# EAGLE design Adafruit RFM+LoRa Breakout (EAGLE 6.6.0)
AUTHOR: KTOWN
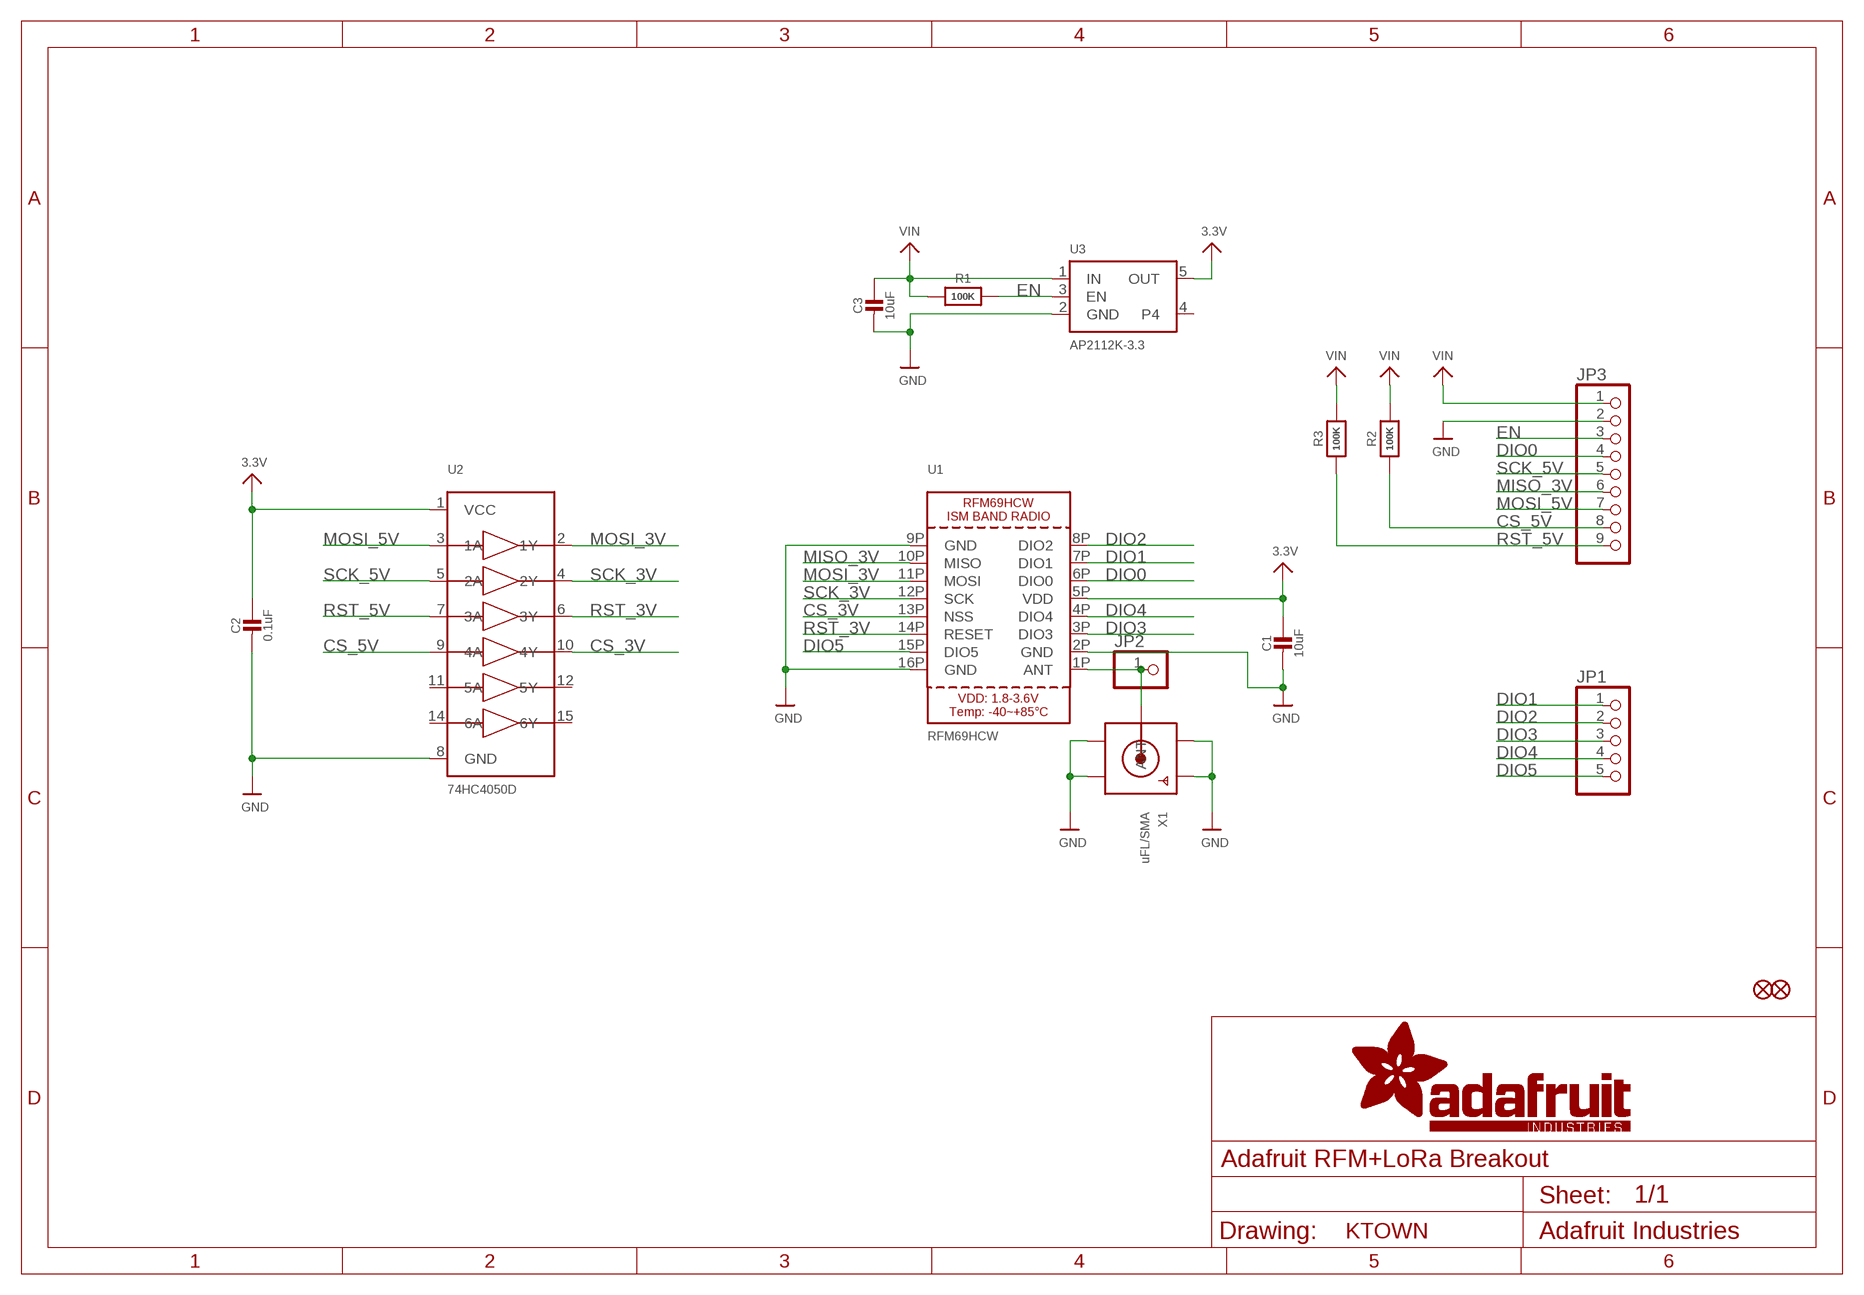
[diagram p0: schematic, sheet 1]

## Parts
C1  10uF  CAP_CERAMIC0805-NOOUTLINE  [0805-NO]
C2  0.1uF  CAP_CERAMIC0805-NOOUTLINE  [0805-NO]
C3  10uF  CAP_CERAMIC0805-NOOUTLINE  [0805-NO]
FID1  FIDUCIAL""  [FIDUCIAL_1MM]
FID2  FIDUCIAL""  [FIDUCIAL_1MM]
JP1  HEADER-1X570MIL  [1X05_ROUND_70]
JP2  HEADER-1X1ROUND  [1X01_ROUND]
JP3  HEADER-1X970MIL  [1X09_ROUND_70]
R1  100K  RESISTOR0805_NOOUTLINE  [0805-NO]
R2  100K  RESISTOR0805_NOOUTLINE  [0805-NO]
R3  100K  RESISTOR0805_NOOUTLINE  [0805-NO]
U1  RFM69HCW  RFM69HCW_SMT  [RFMHCW_SMT]
U2  74HC4050D  74HC4050DTSSOP  [TSSOP16]
U3  AP2112K-3.3  VREG_SOT23-5  [SOT23-5]
X1  uFL/SMA  SMACONNECTOR_EDGE_UFL  [SMA_EDGELAUNCH_UFL]

## Nets
3.3V: C1.1 C2.1 U1.5P(VDD) U2.1(VCC) U3.5(OUT)
CS_3V: U1.13P(NSS) U2.10(4Y)
CS_5V: JP3.8 R2.1 U2.9(4A)
DIO0: JP3.4 U1.6P(DIO0)
DIO1: JP1.1 U1.7P(DIO1)
DIO2: JP1.2 U1.8P(DIO2)
DIO3: JP1.3 U1.3P(DIO3)
DIO4: JP1.4 U1.4P(DIO4)
DIO5: JP1.5 U1.15P(DIO5)
EN: JP3.3 R1.2 U3.3(EN)
GND: C1.2 C2.2 C3.2 JP3.2 U1.2P(GND) U1.9P(GND) U1.16P(GND) U2.8(GND) U3.2(GND) X1.GND@1(GND1) X1.GND@2(GND2) X1.GND@3(GND3) X1.GND@4(GND4)
MISO_3V: JP3.6 U1.10P(MISO)
MOSI_3V: U1.11P(MOSI) U2.2(1Y)
MOSI_5V: JP3.7 U2.3(1A)
N$1: JP2.1 U1.1P(ANT) X1.P(ANT)
RST_3V: U1.14P(RESET) U2.6(3Y)
RST_5V: JP3.9 R3.1 U2.7(3A)
SCK_3V: U1.12P(SCK) U2.4(2Y)
SCK_5V: JP3.5 U2.5(2A)
VIN: C3.1 JP3.1 R1.1 R2.2 R3.2 U3.1(IN)
Unconnected: U2.11(5A) U2.12(5Y) U2.14(6A) U2.15(6Y) U3.4

## Library data of the parts
C1-C3 = microbuilder:CAP_CERAMIC: Ceramic Capacitors For new designs, use the packages preceded by an '_' character since they are more reliable: The following footprints should be used on most boards: _0402 - Standard footprint for regular board layouts _0603 - Standard footprint for regular board layouts _0805 - Standard footprint for regular board layouts _1206 - Standard footprint for regular board layouts For extremely tight-pitch boards where space is at a premium, the following 'micro-pitch' footprints can be used (smaller pads, no silkscreen outline, etc.): _0402MP - Micro-pitch footprint for very dense/compact boards _0603MP - Micro-pitch footprint for very dense/compact boards _0805MP - Micro-pitch footprint for very dense/compact boards _1206MP - Micro-pitch footprint for very dense/compact boards
FID1 FID2 = microbuilder:FIDUCIAL: Fiducial Alignment Points Various fiducial points for machine vision alignment.; BOM: EXCLUDE
JP1 = microbuilder:HEADER-1X5: PIN HEADER
JP2 = microbuilder:HEADER-1X1: PIN HEADER
JP3 = microbuilder:HEADER-1X9: PIN HEADER
R1-R3 = microbuilder:RESISTOR: Resistors For new designs, use the packages preceded by an '_' character since they are more reliable: The following footprints should be used on most boards: _0402 - Standard footprint for regular board layouts _0603 - Standard footprint for regular board layouts _0805 - Standard footprint for regular board layouts _1206 - Standard footprint for regular board layouts For extremely tight-pitch boards where space is at a premium, the following 'micro-pitch' footprints can be used (smaller pads, no silkscreen outline, etc.): _0402MP - Micro-pitch footprint for very dense/compact boards _0603MP - Micro-pitch footprint for very dense/compact boards _0805MP - Micro-pitch footprint for very dense/compact boards _1206MP - Micro-pitch footprint for very dense/compact boards
U1 = microbuilder:RFM69HCW: RFM69HCW - ISM Band RF Transceiver
U2 = microbuilder:74HC4050D: 6-channel level shifter 74HC4050D - 2V-6V Supply SOIC16 Digikey: 74HC4050D,653-ND Mouser: 771-74HC4050D-T TSSOP16 Digikey: 296-9215-1-ND Mouser:
U3 = microbuilder:VREG_SOT23-5: SOT23-5 Fixed Voltage Regulators Part Current Out V Out V In V Dropout θJA (°C/W) TJ (°C) Digikey Part No. ADP121 150mA 3.3V 3.4-5.5V 0.09V @ 150mA -- -- ADP121-AUJZ33R7CT-ND ADP121 150mA 3.0V 3.1-5.5V 0.09V @ 150mA -- -- ADP121-AUJZ30R7CT-ND ADP122 300mA 3.3V 3.4-5.5V 0.085V @ 300mA -- -- ADP122AUJZ-3.3-R7CT-ND ADP1712 300mA 3.3V 3.5-5.5V 0.17V @ 300mA -- -- ADP1712AUJZ-3.3-R7TR-ND AP7311 (Low Cost) 150mA 3.3V 3.5-6V 0.15V @ 150mA -- -- AP7311-33WG-7DICT-ND LD39015M18R 150mA 1.8V 1.9V-5.5V 0.08V @ 100mA -- -- 497-6977-1-ND LP2985A-33DBVR 150mA 3.3V 3.3-16V 0.28V @ 150mA 206 150 296-18479-1-ND MCP1824T-3302E/OT 300mA 3.3V 3.5V-6V 0.2V @ 300mA -- -- MCP1824T-3302E/OTCT-ND MIC5205-2.5YM5 TR 150mA 2.5V 2.7-16V 0.165V @ 150mA -- -- 576-1257-2-ND MIC5205-3.0YM5 TR 150mA 3.0V 3.2V-16V 0.165V @ 150mA -- -- 576-1258-2-ND MIC5205-3.3YM5 TR 150mA 3.3V 3.5V-16V 0.165V @ 150mA -- -- 576-1259-2-ND TPS780330220 150mA 3.3V+2.2V 3.6-5.5V 250mV Max -- -- 296-23332-1-ND TDA3663/N1,135 100mA 3.3V 3.5-45V 0.18V @ 50mA -- -- 568-5343-1-ND Max operating temp can be calculated using θJA, TJ (max junction temperature), and power in watts. Set the "Maximum Ambient Temperature" until it reaches TJ ("Max Junction Temperature"), which is the absolute limit for safe use of the regulator: Heat Sink Temperature Calculator <http://www.daycounter.com/Calculators/Heat-Sink-Temperature-Calculator.phtml> For example, With 12V source into a 3.3V LP2985 and a 30mA load, we are dissipating (12V-3.3V) * 0.03A = 0.261W. With a θJA of 206 °C/W, a TJ of 150°C, and 261mW we can safely use the chip without a heat sink up to 75°C (=147.1°C Junction Temperature).
X1 = microbuilder:SMACONNECTOR: SMA Connector 90° DIP SMA Connector, 50 Ohm (4UConnector: 07259)

## Board
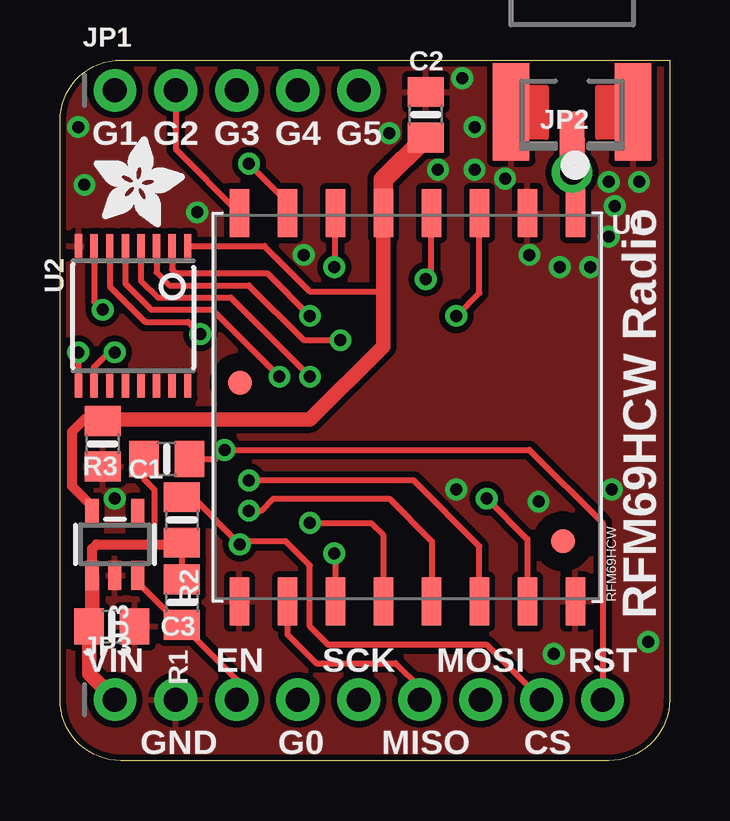
[diagram p1: board, top side]
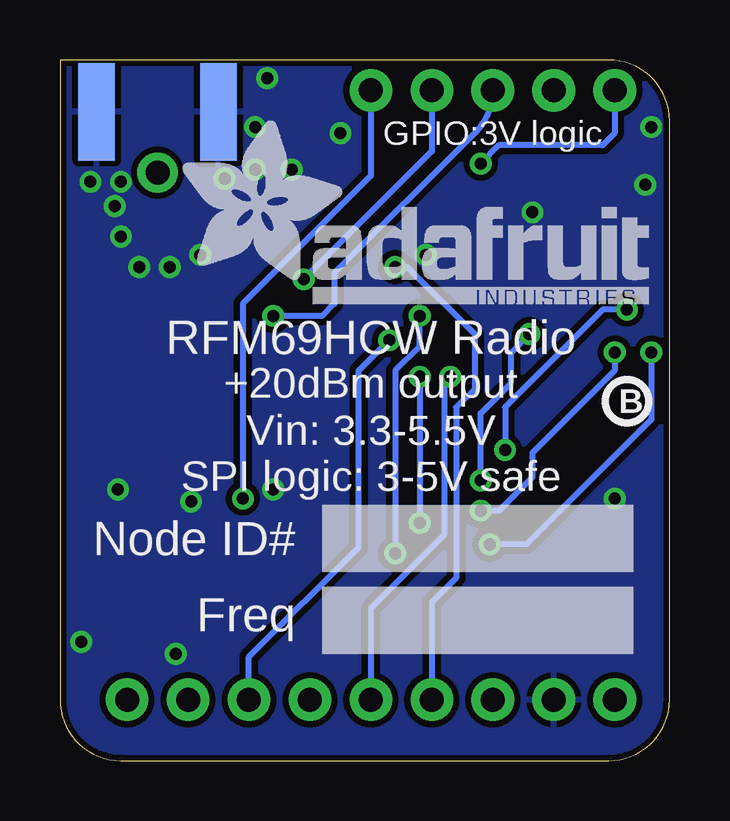
[diagram p2: board, bottom side, seen from below]

Size 25.4 x 29.21 mm. Coordinates in mm from the lower left corner, seen from the top.
Outline: 25.4,29.21 25.4,2.54 arc-90 22.86,0 2.54,0 arc-90 0,2.54 0,26.67 arc-90 2.54,29.21 25.4,29.21
Copper layers (1*16): Top 0.035mm / dielectric 1.5mm / Bottom 0.035mm
Design rules "adafruit *": minimum track width 8mil, minimum drill 15.5mil, track to track 8mil, track to pad 8mil, pad to pad 8mil, via to via 8mil, smd to smd 8mil, copper to edge 10mil, drill to drill 8mil, minimum pad ring 10mil, minimum via ring 8mil, stop-mask expansion 2mil, vias tented up to drill 20mil, thermal gap 10mil

### Footprints (pad centres in the part's own frame; a part is rotated, then mirrored left to right if it is on the bottom)
0805-NO = smd 1.24 x 1.5: 1 -0.95,0; 2 0.95,0
FIDUCIAL_1MM = smd 1 x 1: 1 0,0
1X05_ROUND_70 = drill 1 pad 1.778: 1 -5.08,0; 2 -2.54,0; 3 0,0; 4 2.54,0; 5 5.08,0
1X01_ROUND = drill 1 pad 1.676: 1 0,0
1X09_ROUND_70 = drill 1 pad 1.778: 1 -10.16,0; 2 -7.62,0; 3 -5.08,0; 4 -2.54,0; 5 0,0; 6 2.54,0; 7 5.08,0; 8 7.62,0; 9 10.16,0
RFMHCW_SMT = smd 2 x 0.8: 1P 8.1,-7; 2P 8.1,-5; 3P 8.1,-3; 4P 8.1,-1; 5P 8.1,1; 6P 8.1,3; 7P 8.1,5; 8P 8.1,7; 9P -8.1,7; 10P -8.1,5; 11P -8.1,3; 12P -8.1,1; 13P -8.1,-1; 14P -8.1,-3; 15P -8.1,-5; 16P -8.1,-7
TSSOP16 = smd 0.305 x 0.991: 1 -2.275,-2.918; 2 -1.625,-2.918; 3 -0.975,-2.918; 4 -0.325,-2.918; 5 0.325,-2.918; 6 0.975,-2.918; 7 1.625,-2.918; 8 2.275,-2.918; 9 2.275,2.918; 10 1.625,2.918; 11 0.975,2.918; 12 0.325,2.918; 13 -0.325,2.918; 14 -0.975,2.918; 15 -1.625,2.918; 16 -2.275,2.918
SOT23-5 = smd 0.55 x 1.2: 1 -0.95,-1.3; 2 0,-1.3; 3 0.95,-1.3; 4 0.95,1.3; 5 -0.95,1.3
SMA_EDGELAUNCH_UFL = smd 4.064 x 1.524: GND@1 2.032,-2.54; GND@2 2.032,2.54 | smd 4.064 x 1.524 bottom: GND@3 2.032,2.54; GND@4 2.032,-2.54 | smd 2.032 x 1.016: P 3.048,0

### Placement (x,y rotation side)
C1  1.78,13.21 270 top
C2  15.24,26.92 90 top
C3  2.16,5.59 0 top
FID1  20.95,9.14 90 top
FID2  7.49,15.75 90 top
JP1  7.37,27.94 0 top
JP2  21.34,24.51 0 top
JP3  12.45,2.54 0 top
R1  5.08,6.6 270 top
R2  5.08,10.03 270 top
R3  4.45,12.57 180 top
U1  14.48,14.73 90 top
U2  3.05,18.54 180 top
U3  2.29,9.02 0 top
U$8  [ADAFRUIT_3.5MM]  1.4,22.23 0 top
U$14  [PCBFEAT-REV-040]  1.78,14.99 0 bottom
U$19  [ADAFRUIT_TEXT_20MM]  20.45,19.05 0 bottom
X1  21.34,29.08 270 top

### Tracks (layer width: path | path; a pad name or v marks a point on that pad's centre or on a via)
3.3V
  Top 0.254: U2.1 8.51,21.46 10.41,19.56 13.46,19.56
  Top 0.406: U3.5 1.34,10.6 0.51,11.43 0.51,13.72 1.02,14.22 1.9,14.22 1.84,14.16 C1.1
  Top 0.61: 1.52,14.22 1.9,14.22 2.29,14.22 10.41,14.22 13.46,17.27 13.46,19.56 13.46,22.82 U1.5P 13.48,21.61
  Top 0.813: U1.5P 13.48,24.21 C2.1
CS_3V  (via drill 0.5)
  Top 0.254: U2.10 1.42,16.41 2.03,17.02 v2.29,17.02 | v7.87,10.41 8.38,10.41 8.89,10.92 13.72,10.92 15.49,9.14 15.49,6.65 U1.13P
  Bottom 0.254: v2.29,17.02 2.29,16.26 5.71,12.83 5.71,11.81 7.11,10.41 v7.87,10.41
CS_5V  (via drill 0.5)
  Top 0.254: JP3.8 17.78,4.83 11.18,4.83 10.41,5.59 10.41,8.13 9.4,9.14 7.62,9.14 v7.49,9.02 5.53,10.98 R2.1 | U2.9 0.77,17.01 v0.76,17.02
  Bottom 0.254: v0.76,17.02 0.76,14.22 5.97,9.02 v7.49,9.02
DIO0  (via drill 0.5)
  Top 0.254: v11.43,20.57 11.48,20.62 U1.6P
  Bottom 0.254: v11.43,20.57 10.92,20.57 8.13,17.78 8.13,15.49 8.89,14.73 8.89,7.62 9.91,6.6 JP3.4
DIO1  (via drill 0.5)
  Top 0.254: v7.87,24.89 9.48,23.29 U1.7P
  Bottom 0.254: JP1.1 2.29,26.16 2.79,25.65 7.11,25.65 v7.87,24.89
DIO2
  Top 0.254: JP1.2 4.83,25.48 U1.8P
DIO3  (via drill 0.5)
  Top 0.254: v16.51,18.54 17.48,19.51 U1.3P
  Bottom 0.254: JP1.3 arc45 8.08,26.21 13.97,20.32 13.97,19.05 14.48,18.54 v16.51,18.54
DIO4  (via drill 0.5)
  Top 0.254: v15.24,20.07 15.48,20.3 U1.4P
  Bottom 0.254: JP1.4 9.91,25.4 v15.24,20.07
DIO5  (via drill 0.5)
  Top 0.254: v17.78,10.92 19.48,9.22 U1.15P
  Bottom 0.254: JP1.5 12.45,24.38 17.78,19.05 v17.78,10.92
EN
  Top 0.254: JP3.3 7.37,3.37 R1.2 5.01,5.65 3.24,7.43 U3.3
GND  (via drill 0.5)
  Top 0.406: U3.2 2.29,7.62
  other vias: 16.51,11.3 2.29,10.92 5.71,22.86 10.16,21.08 13.72,26.16 15.75,24.64 17.27,26.42 16.76,28.45 18.54,24.26 22.86,24.13 24.13,24.13 23.11,23.11 22.86,21.84 22.1,20.57 20.83,20.57 19.56,21.08 17.27,24.64 1.02,24 24.51,4.95 20.57,4.45 19.94,10.79 22.99,11.3 0.76,26.42
  pour Bottom (isolate 0.254): 25.4,29.21 25.4,0 0,0 0,29.21
  pour Top (isolate 0.254): 25.4,29.21 25.4,0 0,0 0,29.21
MISO_3V
  Top 0.254: U1.10P 9.48,5.25 10.67,4.06 13.97,4.06 14.99,3.05 JP3.6
MOSI_3V  (via drill 0.5)
  Top 0.254: U2.2 4.67,20.47 4.83,20.32 8.64,20.32 v10.41,18.54 | v11.43,8.64 11.48,8.59 U1.11P
  Bottom 0.254: v11.43,8.64 11.43,16.26 10.41,17.27 v10.41,18.54
MOSI_5V  (via drill 0.5)
  Top 0.254: U2.3 4.02,20.36 4.57,19.81 7.87,19.81 10.16,17.53 v11.68,17.53
  Bottom 0.254: JP3.7 17.53,4.32 12.95,8.89 12.95,16.26 v11.68,17.53
N$1
  Top 0.406: JP2.1 X1.P
  Top 0.813: U1.1P 21.48,25.89 X1.P
RST_3V  (via drill 0.5)
  Top 0.254: U1.14P 17.48,8.94 14.73,11.68 v7.87,11.68 | U2.6 2.07,19.77 3.56,18.29 5.33,18.29 v5.84,17.78
  Bottom 0.254: v7.87,11.68 7.87,14.48 6.6,15.75 6.6,17.02 v5.84,17.78
RST_5V  (via drill 0.5)
  Top 0.254: U2.7 1.42,19.15 v1.78,18.8 | JP3.9 22.61,9.91 19.56,12.95 v6.86,12.95 6.48,12.57 R3.1
  Bottom 0.254: v1.78,18.8 2.79,18.8 6.86,14.73 v6.86,12.95
SCK_3V  (via drill 0.5)
  Top 0.254: U2.4 3.37,20 4.06,19.3 7.11,19.3 v10.41,16 | v10.41,9.91 12.95,9.91 13.46,9.4 13.46,6.65 U1.12P
  Bottom 0.254: v10.41,16 v10.41,9.91
SCK_5V  (via drill 0.5)
  Top 0.254: U2.5 2.72,19.88 3.81,18.8 6.35,18.8 v9.14,16
  Bottom 0.254: v9.14,16 9.4,15.75 9.4,9.4 12.45,6.35 JP3.5
VIN
  Top 0.254: R2.2 R1.1 | R3.2 3.5,11.74 3.94,11.3 3.94,9.14 3.81,9.02
  Top 0.406: U3.1 1.34,8.83 1.52,9.02 3.81,9.02 5.01,9.02 R2.2
  Top 0.61: JP3.1 1.21,3.62 C3.1 1.34,5.71 U3.1

### Text on the board
tPlace: G1 | G2 | G3 | G4 | G5 | RFM69HCW Radio | VIN | EN | SCK | MOSI | RST | GND | G0 | MISO | CS
bPlace: GPIO:3V logic | RFM69HCW Radio | +20dBm output | Vin: 3.3-5.5V / SPI logic: 3-5V safe | Node ID# | Freq